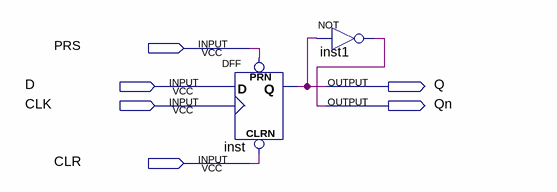
[diagram p0: schematic sheet]
// Quartus schematic ff_D.bdf as structural Verilog: 2 symbols, 6 pins
module ff_D (
  input  PRS,
  input  D,
  input  CLK,
  input  CLR,
  output Q,
  output Qn
);

  DFF inst (.CLRN(CLR), .CLK(CLK), .D(D), .PRN(PRS), .Q(Q));
  not inst1 (Qn, Q);
endmodule
